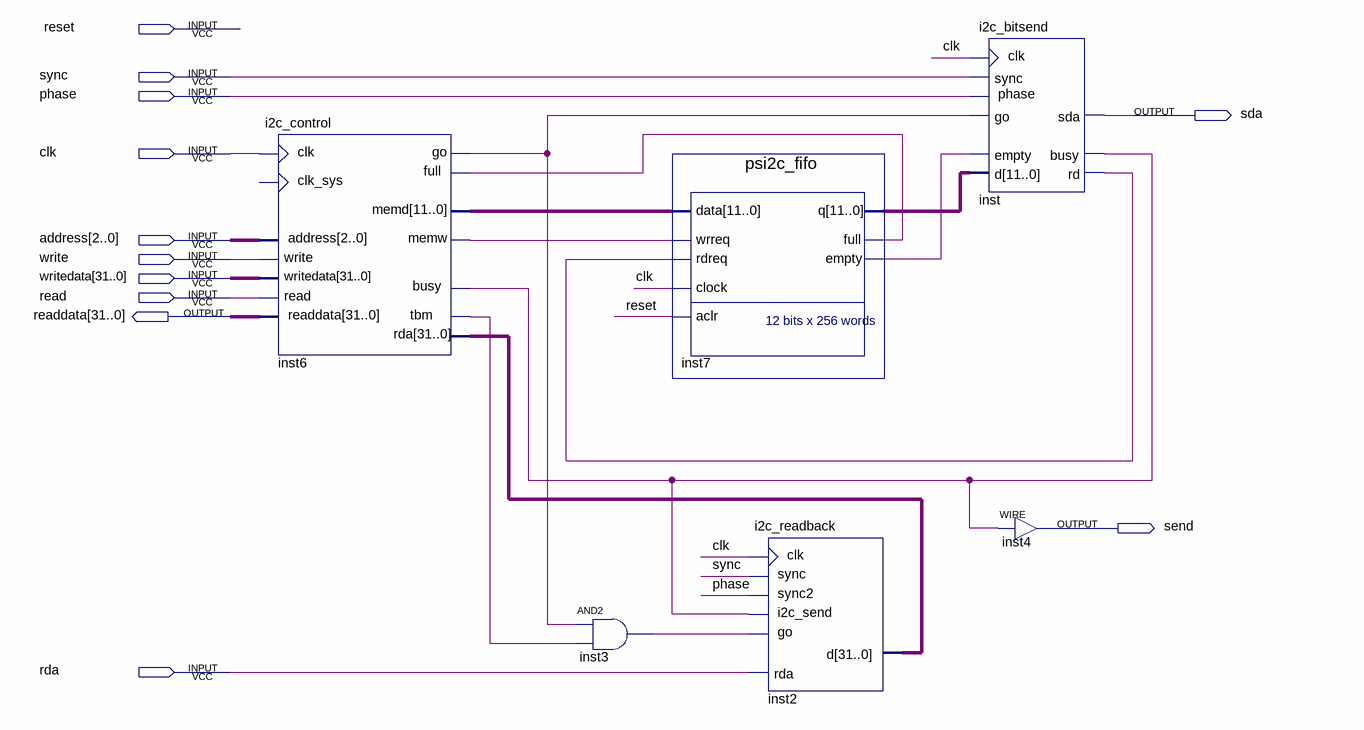
[diagram p0: schematic sheet]
// Quartus schematic i2c_hs.bdf as structural Verilog: 6 symbols, 12 pins
module i2c_hs (
  input  reset,
  input  sync,
  input  phase,
  input  clk,
  input  [2:0] address,
  input  write,
  input  [31:0] writedata,
  input  read,
  input  rda,
  output sda,
  output [31:0] readdata,
  output send
);

  wire inst3_out, inst6_go, inst6_memw, inst6_tbm, inst7_empty, inst7_full, inst_busy, inst_rd;
  wire [11:0] inst6_memd, inst7_q;
  wire [31:0] inst2_d;

  i2c_control inst6 (
    .clk(clk), .busy(inst_busy), .write(write), .writedata(writedata), .read(read), .full(inst7_full),
    .rda(inst2_d), .address(address), .memd(inst6_memd), .memw(inst6_memw), .go(inst6_go),
    .readdata(readdata), .tbm(inst6_tbm));  // open: clk_sys
  and inst3 (inst3_out, inst6_go, inst6_tbm);
  psi2c_fifo inst7 (
    .data(inst6_memd), .wrreq(inst6_memw), .rdreq(inst_rd), .clock(clk), .aclr(reset), .q(inst7_q),
    .full(inst7_full), .empty(inst7_empty));
  i2c_readback inst2 (
    .go(inst3_out), .clk(clk), .sync(sync), .rda(rda), .sync2(phase), .i2c_send(inst_busy), .d(inst2_d));
  i2c_bitsend inst (
    .clk(clk), .sync(sync), .go(inst6_go), .empty(inst7_empty), .d(inst7_q), .phase(phase), .rd(inst_rd),
    .busy(inst_busy), .sda(sda));
  assign send = inst_busy;  // WIRE inst4
endmodule
